# Altium project MainBoard.PrjPcb
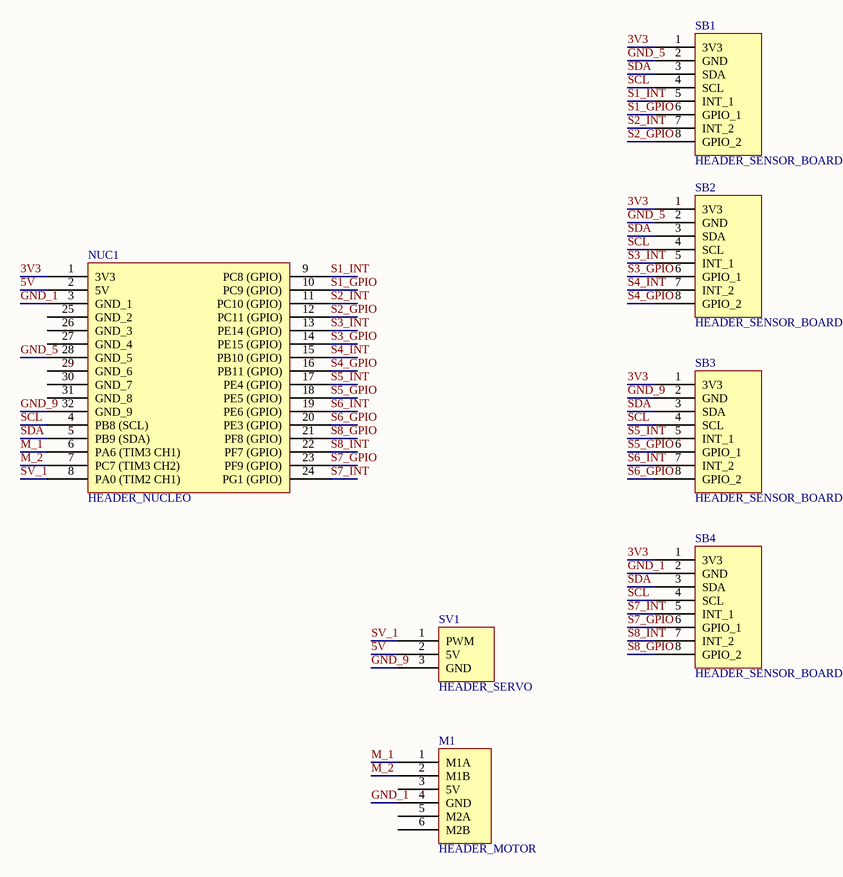
[diagram p0: MainBoard.SchDoc]
1 sheet, 7 parts. Net scope: global (net labels, ports and power ports of the same name join across sheets).
Board file: MainBoard.PcbDoc

## Sheet MainBoard.SchDoc
size A4; SheetNumber: 1; SheetTotal: 1

### Parts
M1  HEADER_MOTOR  [HEADER_MOTOR]
NUC1  HEADER_NUCLEO  [HEADER_NUCLEO]
SB1  HEADER_SENSOR_BOARD  [HEADER_SENSOR_BOARD]
SB2  HEADER_SENSOR_BOARD  [HEADER_SENSOR_BOARD]
SB3  HEADER_SENSOR_BOARD  [HEADER_SENSOR_BOARD]
SB4  HEADER_SENSOR_BOARD  [HEADER_SENSOR_BOARD]
SV1  HEADER_SERVO  [HEADER_3PIN]

### Nets
3V3: NUC1.1(3V3) SB1.1(3V3) SB2.1(3V3) SB3.1(3V3) SB4.1(3V3)
5V: NUC1.2(5V) SV1.2(5V)
GND_1: M1.4(GND) NUC1.3(GND_1) SB4.2(GND)
GND_5: NUC1.28(GND_5) SB1.2(GND) SB2.2(GND)
GND_9: NUC1.32(GND_9) SB3.2(GND) SV1.3(GND)
M_1: M1.1(M1A) NUC1.6(PA6_(TIM3_CH1))
M_2: M1.2(M1B) NUC1.7(PC7_(TIM3_CH2))
S1_GPIO: NUC1.10(PC9_(GPIO)) SB1.6(GPIO_1)
S1_INT: NUC1.9(PC8_(GPIO)) SB1.5(INT_1)
S2_GPIO: NUC1.12(PC11_(GPIO)) SB1.8(GPIO_2)
S2_INT: NUC1.11(PC10_(GPIO)) SB1.7(INT_2)
S3_GPIO: NUC1.14(PE15_(GPIO)) SB2.6(GPIO_1)
S3_INT: NUC1.13(PE14_(GPIO)) SB2.5(INT_1)
S4_GPIO: NUC1.16(PB11_(GPIO)) SB2.8(GPIO_2)
S4_INT: NUC1.15(PB10_(GPIO)) SB2.7(INT_2)
S5_GPIO: NUC1.18(PE5_(GPIO)) SB3.6(GPIO_1)
S5_INT: NUC1.17(PE4_(GPIO)) SB3.5(INT_1)
S6_GPIO: NUC1.20(PE3_(GPIO)) SB3.8(GPIO_2)
S6_INT: NUC1.19(PE6_(GPIO)) SB3.7(INT_2)
S7_GPIO: NUC1.23(PF9_(GPIO)) SB4.6(GPIO_1)
S7_INT: NUC1.24(PG1_(GPIO)) SB4.5(INT_1)
S8_GPIO: NUC1.21(PF8_(GPIO)) SB4.8(GPIO_2)
S8_INT: NUC1.22(PF7_(GPIO)) SB4.7(INT_2)
SCL: NUC1.4(PB8_(SCL)) SB1.4(SCL) SB2.4(SCL) SB3.4(SCL) SB4.4(SCL)
SDA: NUC1.5(PB9_(SDA)) SB1.3(SDA) SB2.3(SDA) SB3.3(SDA) SB4.3(SDA)
SV_1: NUC1.8(PA0_(TIM2_CH1)) SV1.1(PWM)

Not connected (* = marked no-connect by the designer): M1 3(5V) 5(M2A) 6(M2B); NUC1 25(GND_2) 26(GND_3) 27(GND_4) 29(GND_6) 30(GND_7) 31(GND_8)

### Library data of the parts
NUC1 = HEADER_NUCLEO: pin to pad: 1>7 2>9 3>11 4>48 5>50 6>58 7>57 8>95 9>2 10>4 11>6 12>8 13>94 14>96 15>98 16>100 17>30 18>32 19>34 20>36 21>38 22>40 23>42 24>44 25>13 26>28 27>39 28>54 29>71 30>83 31>88 32>93
SB1-SB4 = HEADER_SENSOR_BOARD: Sensor Board header